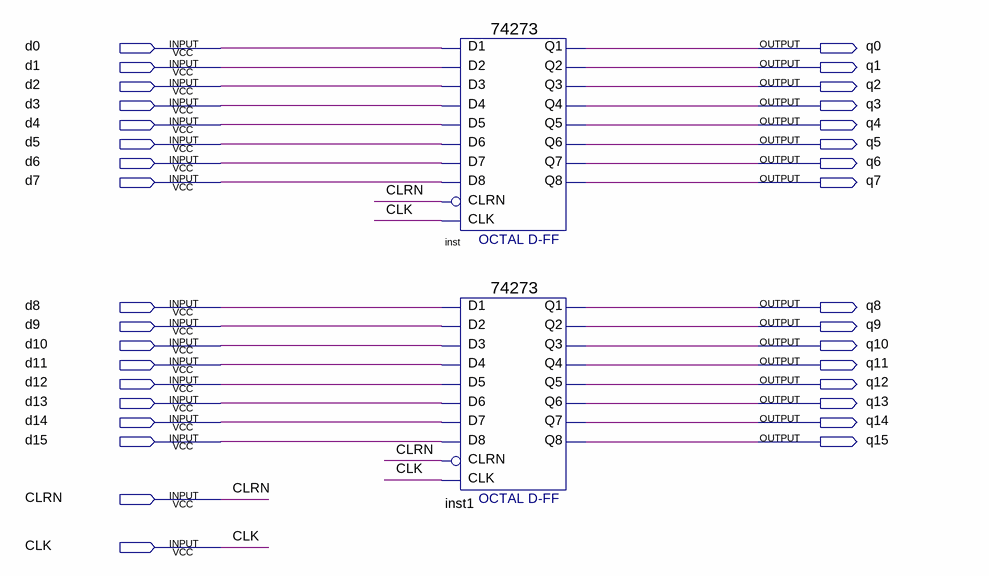
[diagram p0: schematic sheet]
// Quartus schematic Reg16.bdf as structural Verilog: 2 symbols, 34 pins
module Reg16 (
  input  d0,
  input  d1,
  input  d2,
  input  d3,
  input  d4,
  input  d5,
  input  d6,
  input  d7,
  input  d8,
  input  d9,
  input  d10,
  input  d11,
  input  d12,
  input  d13,
  input  d14,
  input  d15,
  input  CLRN,
  input  CLK,
  output q0,
  output q1,
  output q2,
  output q3,
  output q4,
  output q5,
  output q6,
  output q7,
  output q8,
  output q9,
  output q10,
  output q11,
  output q12,
  output q13,
  output q14,
  output q15
);

  \74273  inst (
    .D2(d1), .D3(d2), .D1(d0), .D4(d3), .D7(d6), .D6(d5), .D5(d4), .D8(d7), .CLK(CLK), .CLRN(CLRN), .Q4(q3),
    .Q1(q0), .Q2(q1), .Q3(q2), .Q6(q5), .Q5(q4), .Q7(q6), .Q8(q7));
  \74273  inst1 (
    .D2(d9), .D3(d10), .D1(d8), .D4(d11), .D7(d14), .D6(d13), .D5(d12), .D8(d15), .CLK(CLK), .CLRN(CLRN),
    .Q4(q11), .Q1(q8), .Q2(q9), .Q3(q10), .Q6(q13), .Q5(q12), .Q7(q14), .Q8(q15));
endmodule
